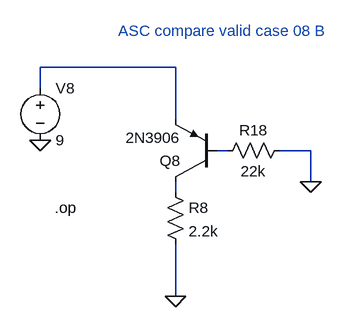
[diagram p0: schematic valid_case_08_b.asc]
valid_case_08_b.asc, the LTspice schematic file:
Version 4.1
SHEET 1 880 680
WIRE 192 -64 -16 -64
WIRE -16 -32 -16 -64
WIRE 192 16 192 -64
WIRE 272 64 256 64
WIRE 400 64 352 64
WIRE 400 112 400 64
WIRE 192 128 192 112
WIRE 192 288 192 208
FLAG 400 112 0
FLAG 192 288 0
FLAG -16 48 0
SYMBOL pnp 256 112 R180
SYMATTR InstName Q8
SYMATTR Value 2N3906
SYMBOL res 176 112 R0
SYMATTR InstName R8
SYMATTR Value 2.2k
SYMBOL res 256 80 R270
WINDOW 0 32 56 VTop 2
WINDOW 3 0 56 VBottom 2
SYMATTR InstName R18
SYMATTR Value 22k
SYMBOL voltage -16 -48 R0
WINDOW 123 0 0 Left 2
WINDOW 39 0 0 Left 2
SYMATTR InstName V8
SYMATTR Value 9
TEXT 40 152 Right 2 !.op
TEXT 104 -120 Left 2 ;ASC compare valid case 08 B

The netlist it stands for:
* valid_case_08_b.asc
Q8 N003 N002 N001 0 2N3906
R8 N003 0 2.2k
R18 N002 0 22k
V8 N001 0 9
.model NPN NPN
.model PNP PNP
.lib standard.bjt
.op
* ASC compare valid case 08 B
.backanno
.end